# Altium schematic sheet PSU_1V2_LD1117A.SchDoc: PSU 1V2
size A4; DocumentNumber: 15; SheetNumber: 15; SheetTotal: 18
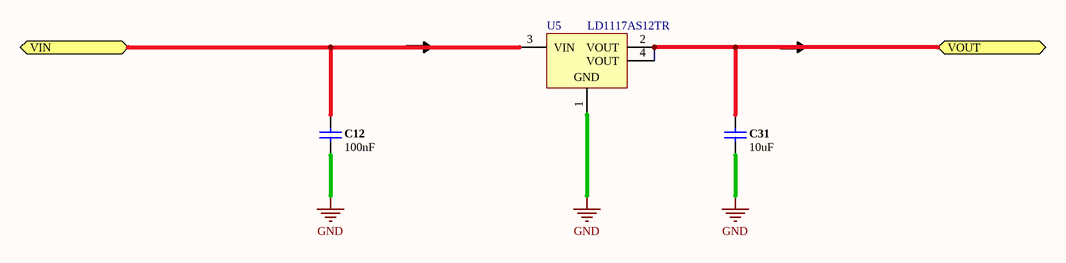
[diagram p0: PSU_1V2_LD1117A.SchDoc]

## Parts
C12  100nF  [0805C-GENERIC]
C31  10uF  [0805C-GENERIC]
U5  LD1117AS12TR  [SOT-223_N]

## Ports
VIN, VOUT

## Nets
GND: C12.2 C31.2 U5.1(GND)
VIN: C12.1 U5.3(VIN) ; port VIN
VOUT: C31.1 U5.2(VOUT) U5.4(VOUT) ; port VOUT

## Notes on the sheet
- Title
- Size:
- Date:
- A4
- Number:
- Time:
- Revision:
- Sheet
- of
- File:

## Library data of the parts
C12 = D-101-0027: Capacitor, Ceramic, 10% 10V 0603 X7R; Polarity: Non-Polarized; Capacitance: 100nF; Dielectric: X7R; Mounting Technology: Surface Mount; Rated Voltage: 10 V; Status: Production; Technology: Ceramic; Tolerance: 10 %; Category: Capacitor
C31 = D-101-0027: Capacitor, Ceramic, 10% 10V 0805 X7R; Polarity: Non-Polarized; Capacitance: 10uF; Dielectric: X7R; Mounting Technology: Surface Mount; Rated Voltage: 10 V; Status: Production; Technology: Ceramic; Tolerance: 10 %; Category: Capacitor
U5 = LD1117AS12TR: 1A, Low Drop Positive Voltage Regulator, 1.2V, 4-Pin SOT-223, Tape and Reel; DatasheetVersion: Dec-2011; PackageVersion: 2010; PackageReference: SOT-223; PackageDescription: 4-Pin SOT-223 Package, 6.5 x 3.5 mm Body, 2.3 mm Pitch, 7 mm Lead Span; PartNumber: LD1117AS12TR; ComponentLink1Description: Manufacturer URL; ComponentLink1URL: http://www.st.com; ComponentLink2Description: Datasheet; ComponentLink2URL: http://www.st.com/internet/com/TECHNICAL_RESOURCES/TECHNICAL_LITERATURE/DATASHEET/CD00002116.pdf